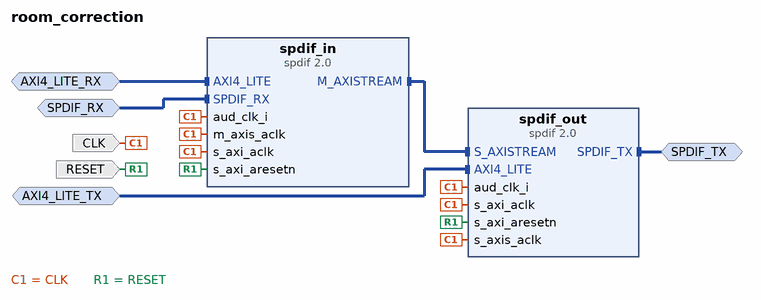
[diagram p0: block diagram of the top level]
# Vivado block design room_correction, xc7z020clg400-1, Vivado 2025.1
create_bd_design room_correction

create_bd_intf_port -mode Slave -vlnv xilinx.com:interface:aximm_rtl:1.0 AXI4_LITE_RX
set_property -dict [list \
  CONFIG.ADDR_WIDTH 16 \
  CONFIG.ARUSER_WIDTH 0 \
  CONFIG.AWUSER_WIDTH 0 \
  CONFIG.BUSER_WIDTH 0 \
  CONFIG.DATA_WIDTH 32 \
  CONFIG.HAS_BRESP 1 \
  CONFIG.HAS_BURST 0 \
  CONFIG.HAS_CACHE 0 \
  CONFIG.HAS_LOCK 0 \
  CONFIG.HAS_PROT 0 \
  CONFIG.HAS_QOS 0 \
  CONFIG.HAS_REGION 0 \
  CONFIG.HAS_RRESP 1 \
  CONFIG.HAS_WSTRB 1 \
  CONFIG.ID_WIDTH 0 \
  CONFIG.NUM_READ_OUTSTANDING 1 \
  CONFIG.NUM_READ_THREADS 1 \
  CONFIG.NUM_WRITE_OUTSTANDING 1 \
  CONFIG.NUM_WRITE_THREADS 1 \
  CONFIG.PROTOCOL AXI4LITE \
  CONFIG.READ_WRITE_MODE READ_WRITE \
  CONFIG.RUSER_BITS_PER_BYTE 0 \
  CONFIG.RUSER_WIDTH 0 \
  CONFIG.WUSER_BITS_PER_BYTE 0 \
  CONFIG.WUSER_WIDTH 0 \
] [get_bd_intf_ports AXI4_LITE_RX]
create_bd_intf_port -mode Slave -vlnv xilinx.com:interface:aximm_rtl:1.0 AXI4_LITE_TX
set_property -dict [list \
  CONFIG.ADDR_WIDTH 16 \
  CONFIG.ARUSER_WIDTH 0 \
  CONFIG.AWUSER_WIDTH 0 \
  CONFIG.BUSER_WIDTH 0 \
  CONFIG.DATA_WIDTH 32 \
  CONFIG.HAS_BRESP 1 \
  CONFIG.HAS_BURST 0 \
  CONFIG.HAS_CACHE 0 \
  CONFIG.HAS_LOCK 0 \
  CONFIG.HAS_PROT 0 \
  CONFIG.HAS_QOS 0 \
  CONFIG.HAS_REGION 0 \
  CONFIG.HAS_RRESP 1 \
  CONFIG.HAS_WSTRB 1 \
  CONFIG.ID_WIDTH 0 \
  CONFIG.NUM_READ_OUTSTANDING 1 \
  CONFIG.NUM_READ_THREADS 1 \
  CONFIG.NUM_WRITE_OUTSTANDING 1 \
  CONFIG.NUM_WRITE_THREADS 1 \
  CONFIG.PROTOCOL AXI4LITE \
  CONFIG.READ_WRITE_MODE READ_WRITE \
  CONFIG.RUSER_BITS_PER_BYTE 0 \
  CONFIG.RUSER_WIDTH 0 \
  CONFIG.WUSER_BITS_PER_BYTE 0 \
  CONFIG.WUSER_WIDTH 0 \
] [get_bd_intf_ports AXI4_LITE_TX]
create_bd_intf_port -mode Slave -vlnv xilinx.com:interface:spdif_rtl:2.0 SPDIF_RX
create_bd_intf_port -mode Master -vlnv xilinx.com:interface:spdif_rtl:2.0 SPDIF_TX
create_bd_port -dir I -type rst RESET
set_property -dict {CONFIG.POLARITY ACTIVE_LOW} [get_bd_ports RESET]
create_bd_port -dir I -type clk CLK
set_property -dict {CONFIG.FREQ_HZ 100000000} [get_bd_ports CLK]

create_bd_cell -type ip -vlnv xilinx.com:ip:spdif:2.0 spdif_in
set_property -dict {CONFIG.AXI_BUFFER_Size 1024} [get_bd_cells spdif_in]
create_bd_cell -type ip -vlnv xilinx.com:ip:spdif:2.0 spdif_out
set_property -dict [list \
  CONFIG.AXI_BUFFER_Size 1024 \
  CONFIG.CSTATUS_REG 0 \
  CONFIG.FIFO_COUNT 1 \
  CONFIG.SPDIF_Mode 1 \
  CONFIG.USERDATA_REG 0 \
] [get_bd_cells spdif_out]

# ---- connections ----

connect_bd_intf_net -intf_net AXI4_LITE_0_1 [get_bd_intf_ports AXI4_LITE_RX] [get_bd_intf_pins spdif_in/AXI4_LITE]
connect_bd_intf_net -intf_net AXI4_LITE_1_1 [get_bd_intf_ports AXI4_LITE_TX] [get_bd_intf_pins spdif_out/AXI4_LITE]
connect_bd_intf_net -intf_net SPDIF_RX_0_1 [get_bd_intf_ports SPDIF_RX] [get_bd_intf_pins spdif_in/SPDIF_RX]
connect_bd_intf_net [get_bd_intf_pins spdif_in/M_AXISTREAM] [get_bd_intf_pins spdif_out/S_AXISTREAM]
connect_bd_intf_net [get_bd_intf_ports SPDIF_TX] [get_bd_intf_pins spdif_out/SPDIF_TX]
connect_bd_net -net clk_wiz_clk_out1 [get_bd_ports CLK] \
  [get_bd_pins spdif_in/aud_clk_i] [get_bd_pins spdif_out/aud_clk_i] [get_bd_pins spdif_in/s_axi_aclk] \
  [get_bd_pins spdif_out/s_axi_aclk] [get_bd_pins spdif_out/s_axis_aclk] [get_bd_pins spdif_in/m_axis_aclk]
connect_bd_net -net rst_clk_wiz_100M_peripheral_aresetn [get_bd_ports RESET] \
  [get_bd_pins spdif_in/s_axi_aresetn] [get_bd_pins spdif_out/s_axi_aresetn]

# ---- address map ----
assign_bd_address -offset 0x0000 -range 64K -target_address_space [get_bd_addr_spaces AXI4_LITE_RX] [get_bd_addr_segs spdif_in/AXI4_LITE/Reg]
assign_bd_address -offset 0x0000 -range 64K -target_address_space [get_bd_addr_spaces AXI4_LITE_TX] [get_bd_addr_segs spdif_out/AXI4_LITE/Reg]

validate_bd_design
save_bd_design
